# EAGLE design bue_steuerung (EAGLE 7.3.0)
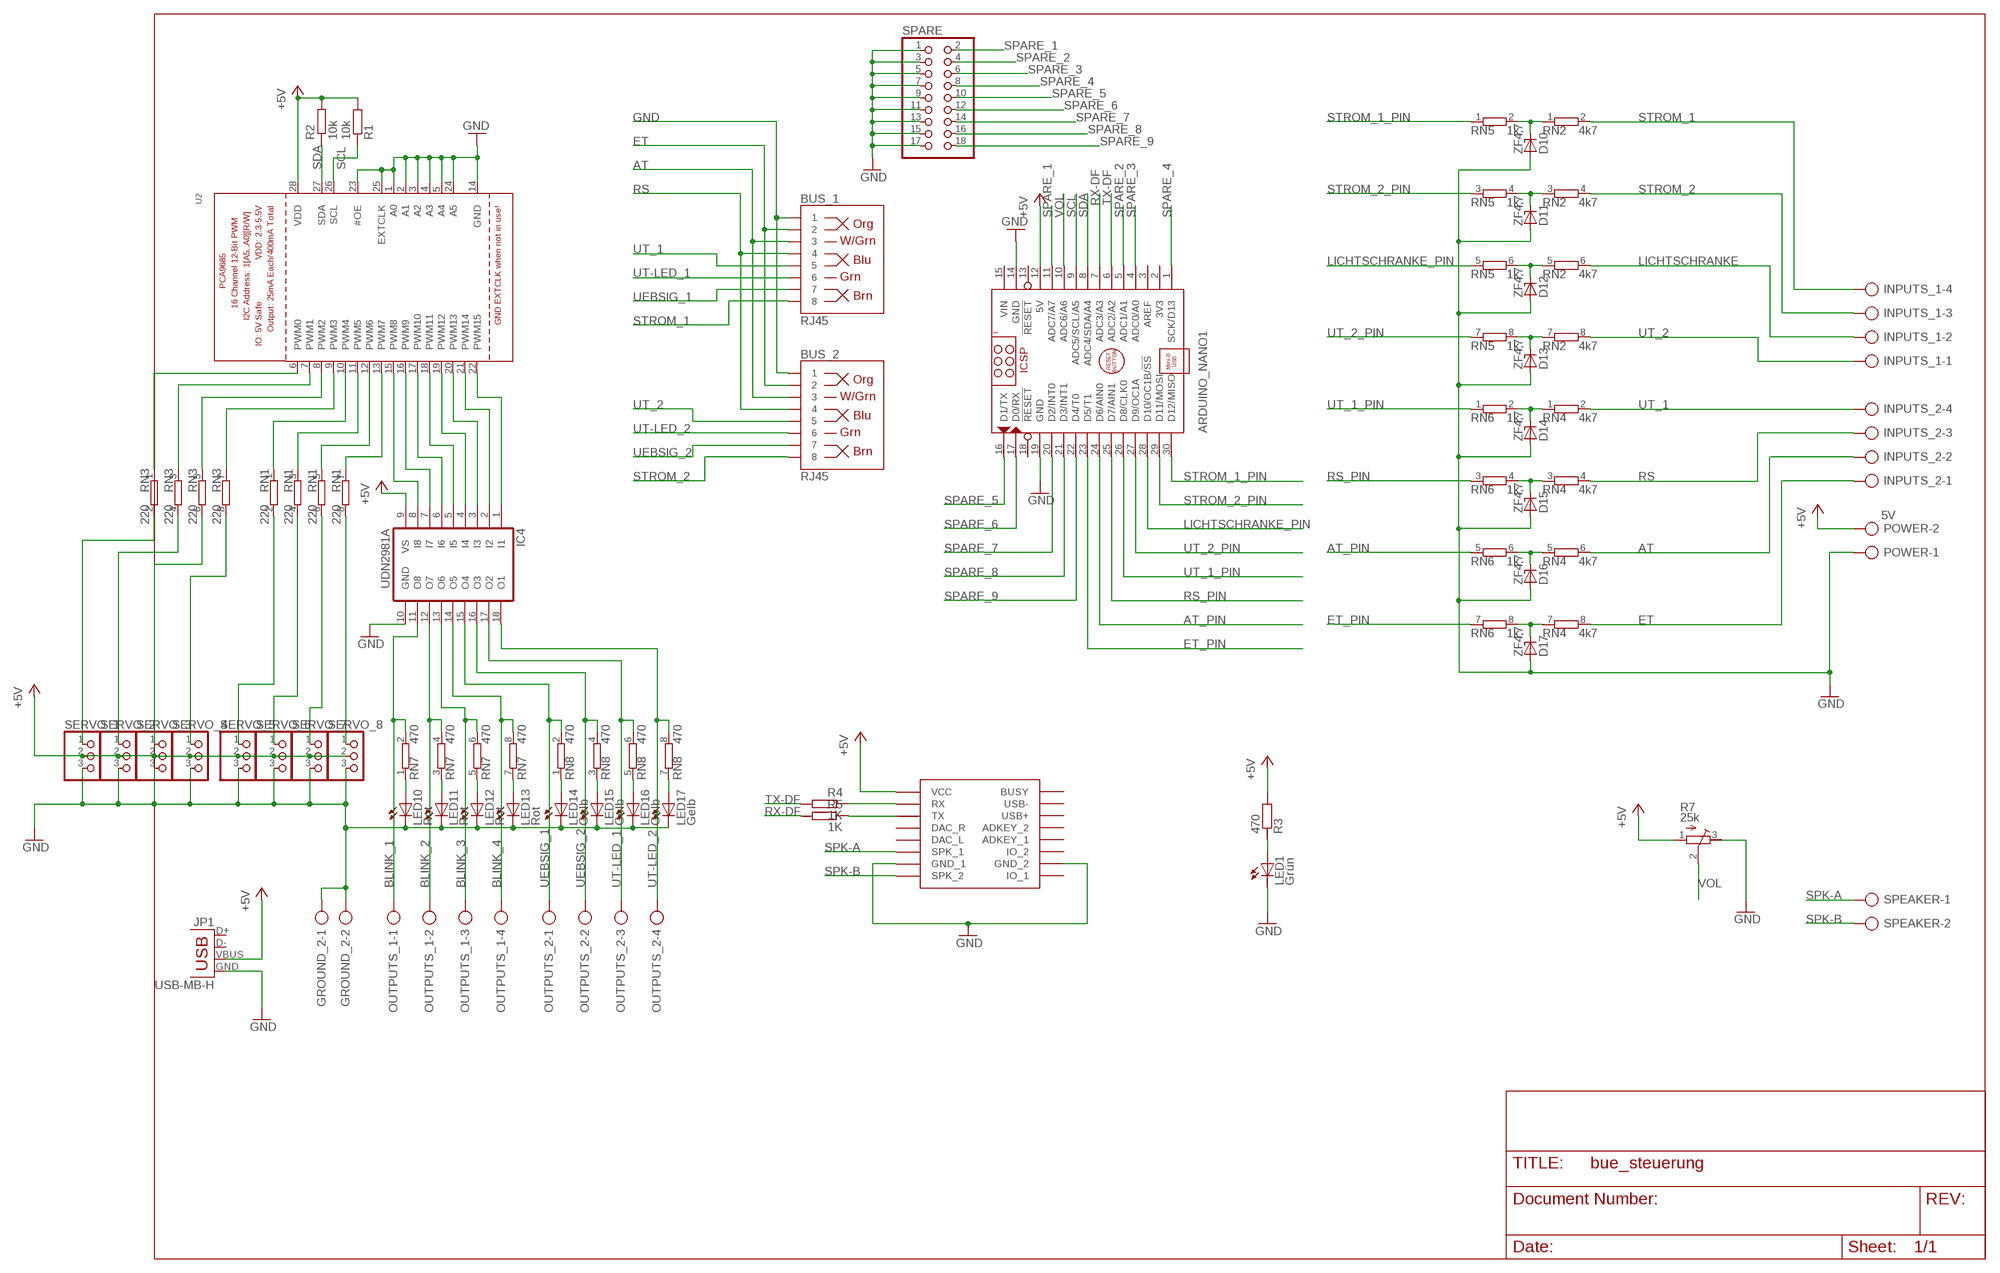
[diagram p0: schematic, sheet 1]

## Parts
ARDUINO_NANO1  ARDUINO_NANO  [ARDUINO_NANO]
BUS_1  RJ45  RJ45-8PTH  [RJ45-8]
BUS_2  RJ45  RJ45-8PTH  [RJ45-8]
D10  ZF4,7  ZENER-DIODEZD-2.5  [ZDIO-2.5]
D11  ZF4,7  ZENER-DIODEZD-5  [ZDIO-5]
D12  ZF4,7  ZENER-DIODEZD-10  [ZDIO-10]
D13  ZF4,7  ZENER-DIODEZD-12.5  [ZDIO12.5]
D14  ZF4,7  ZENER-DIODEZD-12.5  [ZDIO12.5]
D15  ZF4,7  ZENER-DIODEZD-10  [ZDIO-10]
D16  ZF4,7  ZENER-DIODEZD-5  [ZDIO-5]
D17  ZF4,7  ZENER-DIODEZD-2.5  [ZDIO-2.5]
GROUND_2  AK500/2  [AK500/2]
IC4  UDN2981A  [DIL18]
INPUTS_1  AK500/4  [AK500/4]
INPUTS_2  AK500/4  [AK500/4]
JP1  USB-MB-H  [USB-MB-H]
LED1  Grün  LED3MM  [LED3MM]
LED10  Rot  LED3MM  [LED3MM]
LED11  Rot  LED3MM  [LED3MM]
LED12  Rot  LED3MM  [LED3MM]
LED13  Rot  LED3MM  [LED3MM]
LED14  Gelb  LED3MM  [LED3MM]
LED15  Gelb  LED3MM  [LED3MM]
LED16  Gelb  LED3MM  [LED3MM]
LED17  Gelb  LED3MM  [LED3MM]
OUTPUTS_1  AK500/4  [AK500/4]
OUTPUTS_2  AK500/4  [AK500/4]
POWER  5V  AK500/2  [AK500/2]
R1  10k  R-EU_0207/10  [0207/10]
R2  10k  R-EU_0207/10  [0207/10]
R3  470  R-EU_0207/10  [0207/10]
R4  1K  R-EU_0207/10  [0207/10]
R5  1K  R-EU_0207/10  [0207/10]
R7  25k  R-TRIMM64Z  [RTRIM64Z]
RN1  220  E4RP  [SIL8]
RN2  4k7  E4RP  [SIL8]
RN3  220  E4RP  [SIL8]
RN4  4k7  E4RP  [SIL8]
RN5  1k  E4RP  [SIL8]
RN6  1k  E4RP  [SIL8]
RN7  470  E4RP  [SIL8]
RN8  470  E4RP  [SIL8]
SERVO_1  PINHD-1X3  [1X03]
SERVO_2  PINHD-1X3  [1X03]
SERVO_3  PINHD-1X3  [1X03]
SERVO_4  PINHD-1X3  [1X03]
SERVO_5  PINHD-1X3  [1X03]
SERVO_6  PINHD-1X3  [1X03]
SERVO_7  PINHD-1X3  [1X03]
SERVO_8  PINHD-1X3  [1X03]
SPARE  PINHD-2X9  [2X09]
SPEAKER  AK500/2  [AK500/2]
U2  PCA9685  [TSSOP28]
U$1  DFPLAYER  [DFPLAYER]

## Nets
+5V: ARDUINO_NANO1.12(5V) IC4.9(VS) JP1.VBUS POWER.2 R1.2 R2.2 R3.2 R7.1(E) SERVO_1.2 SERVO_2.2 SERVO_3.2 SERVO_4.2 SERVO_5.2 SERVO_6.2 SERVO_7.2 SERVO_8.2 U2.28(VDD) U$1.VCC
AT: BUS_1.3 BUS_2.3 INPUTS_2.2 RN4.6
AT_PIN: ARDUINO_NANO1.24(D6/AIN0) RN6.5
BLINK_1: IC4.11(O8) OUTPUTS_1.1 RN7.2
BLINK_2: IC4.12(O7) OUTPUTS_1.2 RN7.4
BLINK_3: IC4.13(O6) OUTPUTS_1.3 RN7.6
BLINK_4: IC4.14(O5) OUTPUTS_1.4 RN7.8
ET: BUS_1.2 BUS_2.2 INPUTS_2.1 RN4.8
ET_PIN: ARDUINO_NANO1.23(D5/T1) RN6.7
GND: ARDUINO_NANO1.14(GND) ARDUINO_NANO1.19(GND) BUS_1.1 BUS_2.1 D10.A D11.A D12.A D13.A D14.A D15.A D16.A D17.A GROUND_2.1 GROUND_2.2 IC4.10(GND) JP1.GND LED1.K(C) LED10.K(C) LED11.K(C) LED12.K(C) LED13.K(C) LED14.K(C) LED15.K(C) LED16.K(C) LED17.K(C) POWER.1 R7.3(A) SERVO_1.3 SERVO_2.3 SERVO_3.3 SERVO_4.3 SERVO_5.3 SERVO_6.3 SERVO_7.3 SERVO_8.3 SPARE.1 SPARE.3 SPARE.5 SPARE.7 SPARE.9 SPARE.11 SPARE.13 SPARE.15 SPARE.17 U2.1(A0) U2.2(A1) U2.3(A2) U2.4(A3) U2.5(A4) U2.14(GND) U2.23(#OE) U2.24(A5) U2.25(EXTCLK) U$1.GND_1 U$1.GND_2
LICHTSCHRANKE: INPUTS_1.2 RN2.6
LICHTSCHRANKE_PIN: ARDUINO_NANO1.28(D10/OC1B/!SS) RN5.5
N$1: RN1.4 SERVO_6.1
N$2: RN1.6 SERVO_7.1
N$3: RN1.8 SERVO_8.1
N$4: IC4.8(I8) U2.15(PWM8)
N$6: LED14.A RN8.1
N$7: LED1.A R3.1
N$8: R4.1 U$1.RX
N$9: IC4.7(I7) U2.16(PWM9)
N$10: R5.1 U$1.TX
N$13: D17.C RN4.7 RN6.8
N$19: D14.C RN4.1 RN6.2
N$20: D16.C RN4.5 RN6.6
N$21: D15.C RN4.3 RN6.4
N$22: D12.C RN2.5 RN5.6
N$23: D11.C RN2.3 RN5.4
N$24: D10.C RN2.1 RN5.2
N$28: D13.C RN2.7 RN5.8
N$33: IC4.6(I6) U2.17(PWM10)
N$35: IC4.5(I5) U2.18(PWM11)
N$37: IC4.4(I4) U2.19(PWM12)
N$38: IC4.3(I3) U2.20(PWM13)
N$39: RN3.2 SERVO_1.1
N$40: RN3.4 SERVO_2.1
N$41: RN3.6 SERVO_3.1
N$42: RN3.8 SERVO_4.1
N$43: RN1.2 SERVO_5.1
N$45: IC4.2(I2) U2.21(PWM14)
N$46: IC4.1(I1) U2.22(PWM15)
N$47: LED10.A RN7.1
N$48: LED11.A RN7.3
N$49: LED12.A RN7.5
N$50: RN3.1 U2.6(PWM0)
N$51: RN3.3 U2.7(PWM1)
N$52: RN3.5 U2.8(PWM2)
N$53: RN3.7 U2.9(PWM3)
N$54: RN1.1 U2.10(PWM4)
N$55: RN1.3 U2.11(PWM5)
N$56: RN1.5 U2.12(PWM6)
N$57: RN1.7 U2.13(PWM7)
N$58: LED13.A RN7.7
N$59: LED15.A RN8.3
N$60: LED16.A RN8.5
N$62: LED17.A RN8.7
RS: BUS_1.4 BUS_2.4 INPUTS_2.3 RN4.4
RS_PIN: ARDUINO_NANO1.25(D7/AIN1) RN6.3
RX-DF: ARDUINO_NANO1.7(ADC3/A3) R5.2
SCL: ARDUINO_NANO1.9(ADC5/SCL/A5) R1.1 U2.26(SCL)
SDA: ARDUINO_NANO1.8(ADC4/SDA/A4) R2.1 U2.27(SDA)
SPARE_1: ARDUINO_NANO1.11(ADC7/A7) SPARE.2
SPARE_2: ARDUINO_NANO1.5(ADC1/A1) SPARE.4
SPARE_3: ARDUINO_NANO1.4(ADC0/A0) SPARE.6
SPARE_4: ARDUINO_NANO1.1(SCK/D13) SPARE.8
SPARE_5: ARDUINO_NANO1.16(D1/TX) SPARE.10
SPARE_6: ARDUINO_NANO1.17(D0/RX) SPARE.12
SPARE_7: ARDUINO_NANO1.20(D2/INT0) SPARE.14
SPARE_8: ARDUINO_NANO1.21(D3/INT1) SPARE.16
SPARE_9: ARDUINO_NANO1.22(D4/T0) SPARE.18
SPK-A: SPEAKER.1 U$1.SPK1(SPK_1)
SPK-B: SPEAKER.2 U$1.SPK2(SPK_2)
STROM_1: BUS_1.8 INPUTS_1.4 RN2.2
STROM_1_PIN: ARDUINO_NANO1.30(D12/MISO) RN5.1
STROM_2: BUS_2.8 INPUTS_1.3 RN2.4
STROM_2_PIN: ARDUINO_NANO1.29(D11/MOSI) RN5.3
TX-DF: ARDUINO_NANO1.6(ADC2/A2) R4.2
UEBSIG_1: BUS_1.7 IC4.15(O4) OUTPUTS_2.1 RN8.2
UEBSIG_2: BUS_2.7 IC4.16(O3) OUTPUTS_2.2 RN8.4
UT-LED_1: BUS_1.6 IC4.17(O2) OUTPUTS_2.3 RN8.6
UT-LED_2: BUS_2.6 IC4.18(O1) OUTPUTS_2.4 RN8.8
UT_1: BUS_1.5 INPUTS_2.4 RN4.2
UT_1_PIN: ARDUINO_NANO1.26(D8/CLK0) RN6.1
UT_2: BUS_2.5 INPUTS_1.1 RN2.8
UT_2_PIN: ARDUINO_NANO1.27(D9/OC1A) RN5.7
VOL: ARDUINO_NANO1.10(ADC6/A6) R7.2(S)
Unconnected: ARDUINO_NANO1.2(3V3) ARDUINO_NANO1.3(AREF) ARDUINO_NANO1.13(!RESET) ARDUINO_NANO1.18(!RESET) JP1.D+ JP1.D- U$1.ADKEY1(ADKEY_1) U$1.ADKEY2(ADKEY_2) U$1.BUSY U$1.DAC_L U$1.DAC_R U$1.IO1(IO_1) U$1.IO2(IO_2) U$1.USB+ U$1.USB-

## Power pins joined to a net without a drawn wire
VIN: ARDUINO_NANO1.15(VIN)

## Library data of the parts
ARDUINO_NANO1 = ArduinoNanoV30:ARDUINO_NANO: Arduino Nano V3.0 Module Overview: The Arduino Nano is a small, complete, and breadboard-friendly board based on the ATmega328 (Arduino Nano 3.x) or ATmega168 (Arduino Nano 2.x). It has more or less the same functionality of the Arduino Duemilanove, but in a different package. It lacks only a DC power jack, and works with a Mini-B USB cable instead of a standard one. The Nano was designed and is being produced by Gravitech <http://www.gravitech.us/arna30wiatp.html>. General specifications: Item Value Microcontroller Atmel ATmega168 or ATmega328 Operating Voltage (logic level) 5 V Input Voltage (recommended) 7-12 V Input Voltage (limits) 6-20 V Digital I/O Pins 14 (of which 6 provide PWM output) Analog Input Pins 8 DC Current per I/O Pin 40 mA Flash Memory 16 KB (ATmega168) or 32 KB (ATmega328) of which 2 KB used by bootloader SRAM 1 KB (ATmega168) or 2 KB (ATmega328) EEPROM 512 bytes (ATmega168) or 1 KB (ATmega328) Clock Speed 16 MHz Dimensions (Inches) 0.73" x 1.70" Dimensions (mm) 18mm x 45mm Overall height About 9 mm (not including pins) Weigth 5 g Power: The Arduino Nano can be powered via the Mini-B USB connection, 6-20V unregulated external power supply (pin 30), or 5V regulated external power supply (pin 27). The power source is automatically selected to the highest voltage source. Memory: The ATmega168 has 16 KB of flash memory for storing code (of which 2 KB is used for the bootloader); the ATmega328 has 32 KB, (also with 2 KB used for the bootloader). The ATmega168 has 1 KB of SRAM and 512 bytes of EEPROM (which can be read and written with the EEPROM library); the ATmega328 has 2 KB of SRAM and 1 KB of EEPROM. Input and Output: Each of the 14 digital pins on the Nano can be used as an input or output, using pinMode(), digitalWrite(), and digitalRead() functions. They operate at 5 volts. Each pin can provide or receive a maximum of 40 mA and has an internal pull-up resistor (disconnected by default) of 20-50 kOhms. In addition, some pins have specialized functions. Visit Arduino - ArduinoBoardNano <https://www.arduino.cc/en/Main/ArduinoBoardNano>
BUS_1 BUS_2 = SparkFun-Connectors:RJ45-8: RJ45 Jack Simple RJ45, 8-pin connection - connector for common Cat5, Cat5e, and Cat6 Ethernet cables. Footprint not yet proven in production. Connector sku is PRT-00643; Breakout PCB sku is BOB-00716.; PROD_ID: CONN-08506
D10-D17 = diode:ZENER-DIODE: Z-Diode
GROUND_2 POWER SPEAKER = con-ptr500:AK500/2: CONNECTOR; OC_FARNELL: unknown; OC_NEWARK: unknown
IC4 = uln-udn:UDN298*: DRIVER ARRAY Source: Allegro Microsystems Inc. / UDN2981-UDN2984.pdf
INPUTS_1 INPUTS_2 OUTPUTS_1 OUTPUTS_2 = con-ptr500:AK500/4: CONNECTOR; OC_FARNELL: unknown; OC_NEWARK: unknown
JP1 = SparkFun-Connectors:USB: USB Connectors USB-B-PTH is fully proven SKU : PRT-00139/CONN-08278 USB-miniB is fully proven SKU : PRT-00587 USB-A-PCB is untested. USB-A-H is throughly reviewed, but untested. Spark Fun Electronics SKU : PRT-00437 USB-B-SMT is throughly reviewed, but untested. Needs silkscreen touching up. USB-A-S has not been used/tested USB-MB-H has not been used/tested USB-MICROB has been used. CONN-09505
LED1 LED10-LED17 = adafruit:LED: LED OSRAM: - CHIPLED LG R971, LG N971, LY N971, LG Q971, LY Q971, LO R971, LY R971 LH N974, LH R974 LS Q976, LO Q976, LY Q976 LO Q996 - Hyper CHIPLED LW Q18S LB Q993, LB Q99A, LB R99A - SideLED LS A670, LO A670, LY A670, LG A670, LP A670 LB A673, LV A673, LT A673, LW A673 LH A674 LY A675 LS A676, LA A676, LO A676, LY A676, LW A676 LS A679, LY A679, LG A679 - Hyper Micro SIDELED® LS Y876, LA Y876, LO Y876, LY Y876 LT Y87S - SmartLED LW L88C, LW L88S LB L89C, LB L89S, LG L890 LS L89K, LO L89K, LY L89K LS L896, LA L896, LO L896, LY L896 - TOPLED LS T670, LO T670, LY T670, LG T670, LP T670 LSG T670, LSP T670, LSY T670, LOP T670, LYG T670 LG T671, LOG T671, LSG T671 LB T673, LV T673, LT T673, LW T673 LH T674 LS T676, LA T676, LO T676, LY T676, LB T676, LH T676, LSB T676, LW T676 LB T67C, LV T67C, LT T67C, LS T67K, LO T67K, LY T67K, LW E67C LS E67B, LA E67B, LO E67B, LY E67B, LB E67C, LV E67C, LT E67C LW T67C LS T679, LY T679, LG T679 LS T770, LO T770, LY T770, LG T770, LP T770 LB T773, LV T773, LT T773, LW T773 LH T774 LS E675, LA E675, LY E675, LS T675 LS T776, LA T776, LO T776, LY T776, LB T776 LHGB T686 LT T68C, LB T68C - Hyper Mini TOPLED® LB M676 - Mini TOPLED Santana® LG M470 LS M47K, LO M47K, LY M47K Source: http://www.osram.convergy.de/
R1-R5 = resistor:R-EU_: RESISTOR, European symbol
R7 = resistor:R-TRIMM: Trimm resistor
RN1-RN8 = resistor-sil:E4RP: SIL RESISTOR; OC_FARNELL: unknown; OC_NEWARK: unknown
SERVO_1-SERVO_8 = pinhead:PINHD-1X3: PIN HEADER
SPARE = pinhead:PINHD-2X9: PIN HEADER
U2 = adafruit:PCA9685: PCA9685 - 16 Channel 12-Bit I2C PWM Controller 5.0V tolerant 16 channel, 12-bit I2C PWM controller with 25mA per output (max. 400mA total) Digikey: 568-5931-1-ND
U$1 = DFPlayer_v1:DFPLAYER

## Board
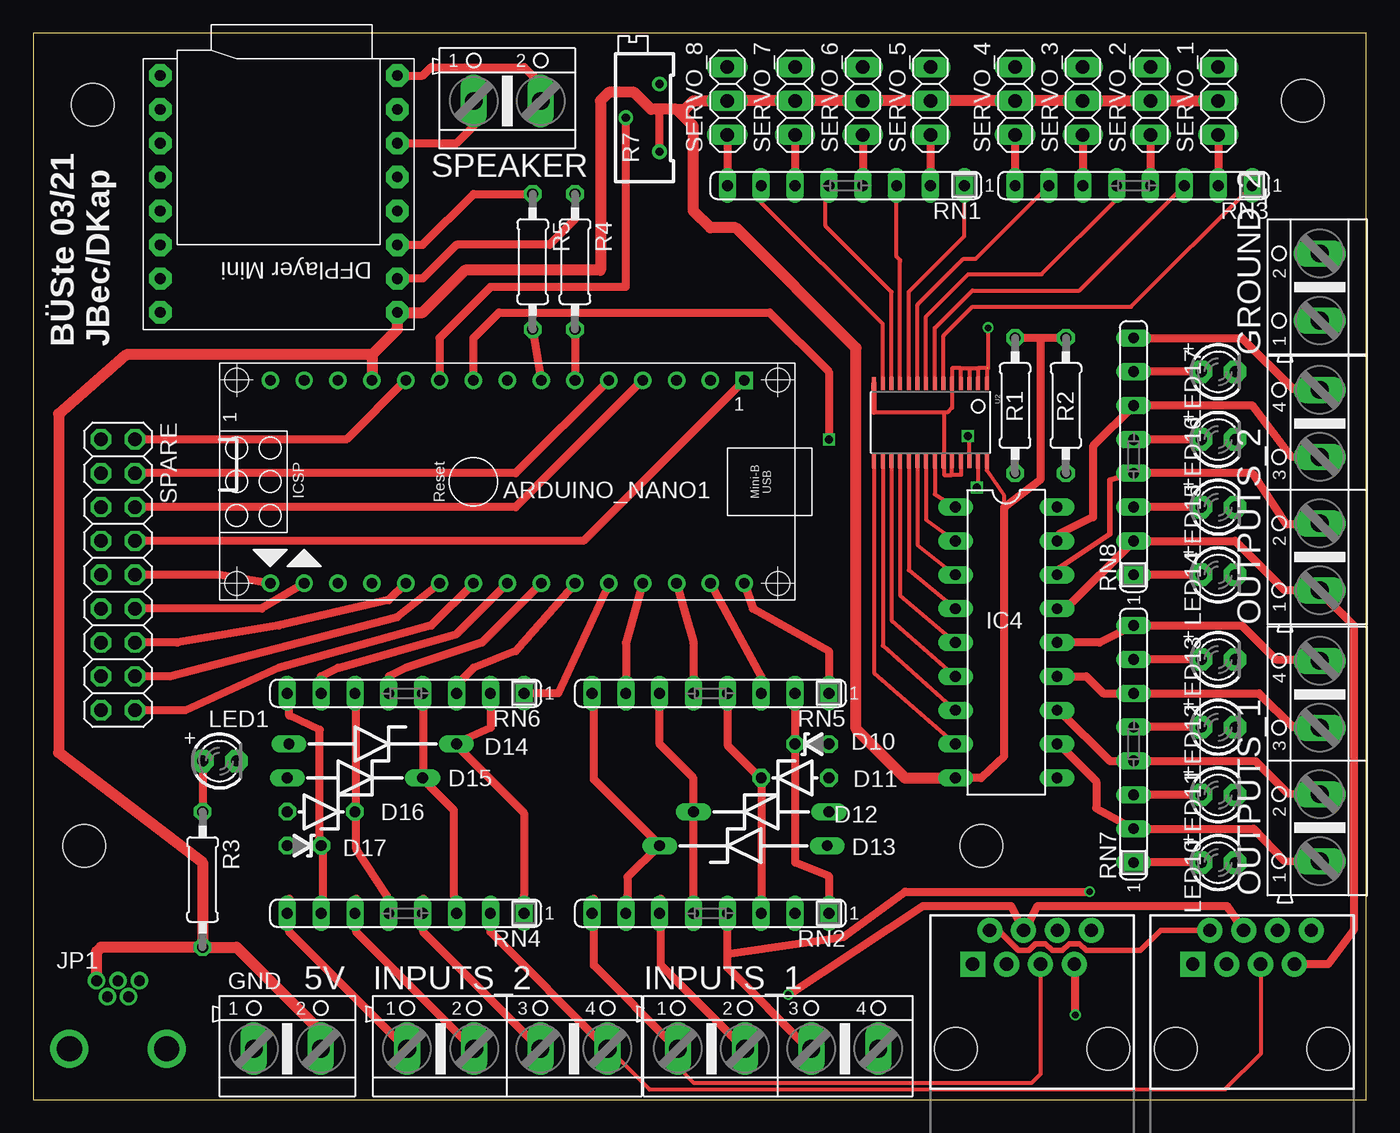
[diagram p1: board, top side]
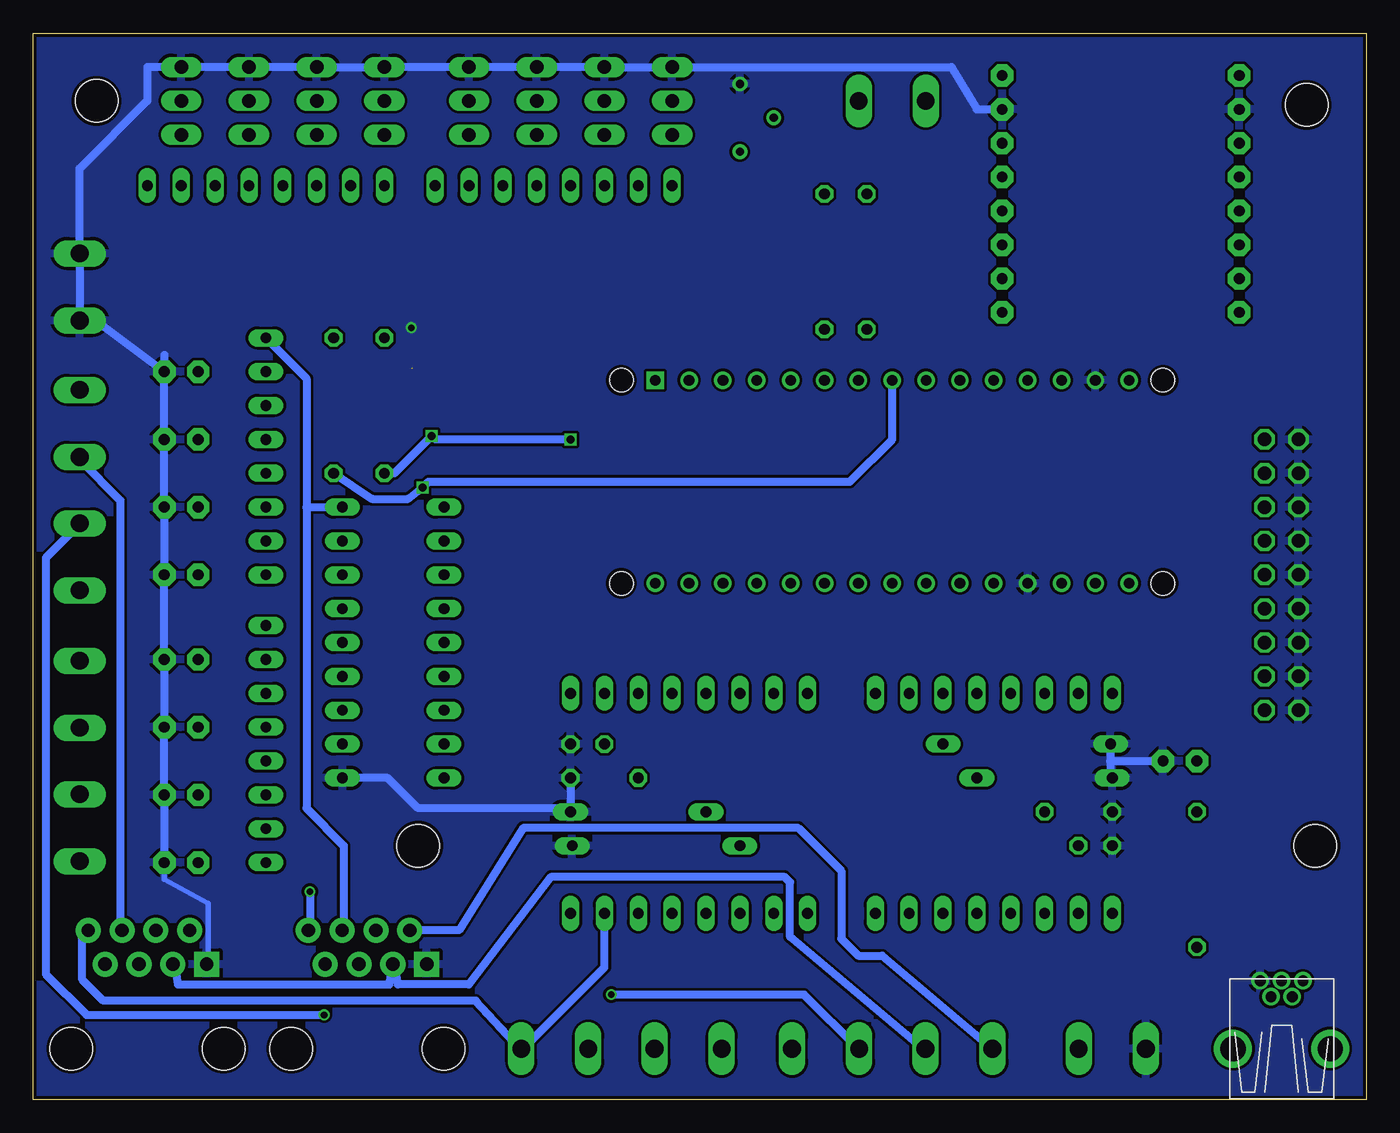
[diagram p2: board, bottom side, seen from below]

Size 100 x 80 mm. Coordinates in mm from the lower left corner, seen from the top.
Outline: 0,0 100,0 100,80 0,80 0,0
Copper layers (1*16): Top 0.035mm / dielectric 1.5mm / Bottom 0.035mm
Design rules "ITEADstudio_DRC_smaller_pad_restrings *": minimum track width 12mil, minimum drill 12mil, track to track 8mil, track to pad 8mil, pad to pad 8mil, via to via 8mil, smd to smd 0mil, copper to edge 10mil, drill to drill 10mil, minimum pad ring 10mil, minimum via ring 6mil, stop-mask expansion 2mil, vias tented up to drill 100mil, thermal gap 10mil
Holes 3.2 mm at 95.25,74.93 3.81,19.05 4.47,74.63 71.12,19.05

### Footprints (pad centres in the part's own frame; a part is rotated, then mirrored left to right if it is on the bottom)
ARDUINO_NANO = drill 0.8 square: 1 -20.32,-7.62 | drill 0.8: 2 -17.78,-7.62; 3 -15.24,-7.62; 4 -12.7,-7.62; 5 -10.16,-7.62; 6 -7.62,-7.62; 7 -5.08,-7.62; 8 -2.54,-7.62; 9 0,-7.62; 10 2.54,-7.62; 11 5.08,-7.62; 12 7.62,-7.62; 13 10.16,-7.62; 14 12.7,-7.62; 15 15.24,-7.62; 16 15.24,7.62; 17 12.7,7.62; 18 10.16,7.62; 19 7.62,7.62; 20 5.08,7.62; 21 2.54,7.62; 22 0,7.62; 23 -2.54,7.62; 24 -5.08,7.62; 25 -7.62,7.62; 26 -10.16,7.62; 27 -12.7,7.62; 28 -15.24,7.62; 29 -17.78,7.62; 30 -20.32,7.62 | hole 1.778: -22.86,-7.62; -22.86,7.62; 17.78,7.62; 17.78,-7.62
RJ45-8 = drill 1 pad 1.88 square: 1 -4.445,6.35 | drill 1 pad 1.88: 2 -3.175,8.89; 3 -1.905,6.35; 4 -0.635,8.89; 5 0.635,6.35; 6 1.905,8.89; 7 3.175,6.35; 8 4.445,8.89 | hole 3.2: -5.715,0; 5.715,0
ZDIO-2.5 = drill 0.813 octagon: A 1.27,0; C -1.27,0
ZDIO-5 = drill 0.813 octagon: A 2.54,0; C -2.54,0
ZDIO-10 = drill 0.813 long: A 5.08,0; C -5.08,0
ZDIO12.5 = drill 0.813 long: A 6.223,0; C -6.35,0
AK500/2 = drill 1.321 long: 1 -2.515,0; 2 2.515,0
DIL18 = drill 0.813 long: 1 -10.16,-3.81; 2 -7.62,-3.81; 3 -5.08,-3.81; 4 -2.54,-3.81; 5 0,-3.81; 6 2.54,-3.81; 7 5.08,-3.81; 8 7.62,-3.81; 9 10.16,-3.81; 10 10.16,3.81; 11 7.62,3.81; 12 5.08,3.81; 13 2.54,3.81; 14 0,3.81; 15 -2.54,3.81; 16 -5.08,3.81; 17 -7.62,3.81; 18 -10.16,3.81
AK500/4 = drill 1.321 long: 1 -7.518,0; 2 -2.489,0; 3 2.489,0; 4 7.518,0
USB-MB-H = drill 0.8: D+ 5.1,0; D- 3.9,0.8; GND 5.1,-1.6; ID 3.9,-0.8; VBUS 5.1,1.6 | drill 1.9: P$6 0,-3.65; P$7 0,3.65
LED3MM = drill 0.813 pad 1.676 octagon: A -1.27,0; K 1.27,0
0207/10 = drill 0.813 octagon: 1 -5.08,0; 2 5.08,0
RTRIM64Z = drill 0.61: 1 0,-2.54; 2 -2.54,0; 3 0,2.54
SIL8 = drill 0.813 long: 1 -8.89,0; 2 -6.35,0; 3 -3.81,0; 4 -1.27,0; 5 1.27,0; 6 3.81,0; 7 6.35,0; 8 8.89,0
1X03 = drill 1.016 long: 1 -2.54,0; 2 0,0; 3 2.54,0
2X09 = drill 1.016 octagon: 1 -10.16,-1.27; 2 -10.16,1.27; 3 -7.62,-1.27; 4 -7.62,1.27; 5 -5.08,-1.27; 6 -5.08,1.27; 7 -2.54,-1.27; 8 -2.54,1.27; 9 0,-1.27; 10 0,1.27; 11 2.54,-1.27; 12 2.54,1.27; 13 5.08,-1.27; 14 5.08,1.27; 15 7.62,-1.27; 16 7.62,1.27; 17 10.16,-1.27; 18 10.16,1.27
TSSOP28 = smd 0.305 x 0.991: 1 -4.225,-2.918; 2 -3.575,-2.918; 3 -2.925,-2.918; 4 -2.275,-2.918; 5 -1.625,-2.918; 6 -0.975,-2.918; 7 -0.325,-2.918; 8 0.325,-2.918; 9 0.975,-2.918; 10 1.625,-2.918; 11 2.275,-2.918; 12 2.925,-2.918; 13 3.575,-2.918; 14 4.225,-2.918; 15 4.225,2.918; 16 3.575,2.918; 17 2.925,2.918; 18 2.275,2.918; 19 1.625,2.918; 20 0.975,2.918; 21 0.325,2.918; 22 -0.325,2.918; 23 -0.975,2.918; 24 -1.625,2.918; 25 -2.275,2.918; 26 -2.925,2.918; 27 -3.575,2.918; 28 -4.225,2.918
DFPLAYER = drill 0.8 pad 1.676 octagon: ADKEY1 8.89,-1.27; ADKEY2 8.89,1.27; BUSY 8.89,8.89; DAC_L -8.89,-1.27; DAC_R -8.89,1.27; GND_1 -8.89,-6.35; GND_2 8.89,-6.35; IO1 8.89,-8.89; IO2 8.89,-3.81; RX -8.89,6.35; SPK1 -8.89,-3.81; SPK2 -8.89,-8.89; TX -8.89,3.81; USB+ 8.89,3.81; USB- 8.89,6.35; VCC -8.89,8.89

### Placement (x,y rotation side)
ARDUINO_NANO1  33.02,46.35 180 top
BUS_1  91.44,3.81 0 top
BUS_2  74.93,3.81 0 top
D10  58.42,26.67 0 top
D11  57.15,24.13 0 top
D12  54.61,21.59 0 top
D13  53.34,19.05 0 top
D14  25.4,26.67 180 top
D15  24.13,24.13 180 top
D16  21.59,21.59 180 top
D17  20.32,19.05 180 top
GROUND_2  96.52,60.96 90 top
IC4  73,34.29 270 top
INPUTS_1  55.88,3.81 0 top
INPUTS_2  35.56,3.81 0 top
JP1  6.35,3.81 90 top
LED1  13.97,25.4 0 top
LED10  88.9,17.78 0 top
LED11  88.9,22.86 0 top
LED12  88.9,27.94 0 top
LED13  88.9,33.02 0 top
LED14  88.9,39.37 0 top
LED15  88.9,44.45 0 top
LED16  88.9,49.53 0 top
LED17  88.9,54.61 0 top
OUTPUTS_1  96.52,25.4 90 top
OUTPUTS_2  96.52,45.72 90 top
POWER  19.05,3.81 0 top
R1  73.66,52.07 90 top
R2  77.47,52.07 90 top
R3  12.7,16.51 270 top
R4  40.64,62.87 270 top
R5  37.47,62.87 270 top
R7  46.99,73.66 0 top
RN1  60.96,68.58 180 top
RN2  50.8,13.97 180 top
RN3  82.55,68.58 180 top
RN4  27.94,13.97 180 top
RN5  50.8,30.48 180 top
RN6  27.94,30.48 180 top
RN7  82.55,26.67 90 top
RN8  82.55,48.26 90 top
SERVO_1  88.9,74.93 90 top
SERVO_2  83.82,74.93 90 top
SERVO_3  78.74,74.93 90 top
SERVO_4  73.66,74.93 90 top
SERVO_5  67.31,74.93 90 top
SERVO_6  62.23,74.93 90 top
SERVO_7  57.15,74.93 90 top
SERVO_8  52.07,74.93 90 top
SPARE  6.35,39.37 270 top
SPEAKER  35.56,74.93 0 top
U2  67.31,50.8 180 top
U$1  18.41,67.94 180 top

### Tracks (layer width: path | path; a pad name or v marks a point on that pad's centre or on a via)
+5V
  Top 0.305: 72.85,44.45 72.85,45.26 71.53,47.21 U2.28
  Top 0.61: SERVO_8.2 SERVO_7.2 SERVO_6.2 SERVO_5.2 SERVO_4.2 | R2.2 75.56,57.15 | 75.56,57.15 R1.2 | IC4.9 71.12,24.13 72.85,25.76 72.85,44.45 75.56,46.53 75.56,57.15 | R7.1 46.99,74.3
  Top 0.813: SERVO_1.2 SERVO_2.2 SERVO_3.2 SERVO_4.2 SERVO_8.2 49.53,74.93 48.9,74.3 48.26,74.3 | 25.4,55.88 6.99,55.88 1.91,51.44 1.91,26.04 12.7,17.78 R3.2 | R3.2 5.08,11.43 4.75,11.1 JP1.VBUS | R3.2 15.24,11.43 21.59,5.08 21.59,3.83 POWER.2 | 25.4,55.88 27.3,57.78 U$1.VCC 29.21,59.05 32.38,62.23 42.55,62.23 42.55,74.93 43.18,75.56 45.09,75.56 46.35,74.3 46.99,74.3 48.26,74.3 | 48.26,74.3 49.53,73.03 49.53,66.67 50.8,65.41 52.7,65.41 61.72,56.39 61.72,27.81 65.41,24.13 IC4.9 | 25.4,55.88 ARDUINO_NANO1.12
AT
  Top 0.406: 32.92,3.89 INPUTS_2.2
  Top 0.61: 32.92,3.89 24.23,12.57 24.23,15.09 RN4.6
  Bottom 0.305: 72.9,10.16 BUS_2.3 | 33.27,3.81 INPUTS_2.2
  Bottom 0.61: BUS_1.3 89.41,10.16 89.15,8.64 73.28,8.64 BUS_2.3 | 72.9,10.16 72.64,8.64 67.31,8.64 61.16,16.69 43.64,16.69 43.23,16.31 43.23,12.19 33.27,3.81
AT_PIN
  Top 0.61: ARDUINO_NANO1.24 33.66,34.29 27.94,32.38 26.67,31.75 RN6.5
BLINK_1
  Top 0.406: 76.96,26.67 IC4.11
  Top 0.61: OUTPUTS_1.1 93.85,17.91 91.57,20.32 RN7.2 79.76,21.84 79.76,23.88 76.96,26.67
BLINK_2
  Top 0.305: 76.96,29.21 IC4.12
  Top 0.61: OUTPUTS_1.2 94.11,22.99 91.69,25.4 RN7.4 80.77,25.4 76.96,29.21
BLINK_3
  Top 0.305: 96.52,27.94 OUTPUTS_1.3
  Top 0.61: IC4.13 78.99,31.75 80.26,30.48 RN7.6 91.95,30.48 94.49,27.94 96.52,27.94
BLINK_4
  Top 0.305: 96.52,33.02 OUTPUTS_1.4
  Top 0.61: IC4.14 80.01,34.29 RN7.8 90.68,35.56 93.22,33.02 96.52,33.02
ET
  Top 0.406: 27.89,3.89 INPUTS_2.1 | BUS_2.2 72.39,12.7 73.91,11.18 74.68,11.18 75.18,11.68 75.95,11.68 76.45,11.18 77.22,11.18 77.72,11.68 78.49,11.68 78.99,11.18 83.06,11.18 84.58,12.7 BUS_1.2
  Top 0.61: 27.89,3.89 19.2,12.57 19.2,15.09 RN4.8
  Bottom 0.305: 28.19,3.81 INPUTS_2.1
  Bottom 0.61: BUS_2.2 68.07,12.7 63.25,20.37 42.6,20.37 39.37,17.14 39.37,12.06 38.1,10.79 36.3,10.79 INPUTS_2.1
ET_PIN
  Top 0.61: ARDUINO_NANO1.23 31.75,34.92 22.86,32.38 21.59,31.75 RN6.7
GND  (via drill 0.5)  (1 unrouted)
  Top 0.305: 69.6,48.01 U2.25 69.6,46.86 68.94,46.86 | 68.33,51.56 68.58,51.56 68.94,51.92 U2.5 68.94,54.86 69.6,54.86 | 68.33,51.56 63.12,51.56 63.09,51.6 | 68.33,51.56 68.33,48.01 | 68.33,48.01 U2.23 | v71.63,57.91 71.63,54.86 | U2.4 69.6,54.86 | 68.94,46.86 U2.24 | 68.33,48.01 68.33,46.86 68.94,46.86 | 69.6,54.86 70.23,54.86 | 70.23,54.86 70.89,54.86 | U2.1 71.53,54.86 70.89,54.86 | 70.23,54.86 U2.3 | 70.89,54.86 U2.2
  Top 0.406: 63.09,51.6 U2.14
  Bottom 0.305: 59.66,21.72 59.66,21.84 | 96.52,63.25 GROUND_2.2 | 96.52,58.42 GROUND_2.1
  Bottom 0.406: LED10.K 90.17,16.51 86.87,14.73 86.87,10.16 BUS_1.1
  Bottom 0.61: 59.66,24 59.66,21.84 71.12,21.84 73.41,24.13 IC4.10 | 19.2,26.52 19.2,25.4 | 19.2,25.4 19.2,24.23 | LED17.K LED16.K LED15.K LED14.K LED13.K LED12.K LED11.K LED10.K | 19.2,25.4 LED1.K | GROUND_2.1 GROUND_2.2 96.52,69.85 91.44,74.93 91.44,77.47 SERVO_1.3 SERVO_2.3 SERVO_3.3 SERVO_4.3 SERVO_5.3 SERVO_6.3 SERVO_7.3 SERVO_8.3 31.11,77.47 29.21,74.3 U$1.GND_1 | 96.52,58.42 95.25,58.42 LED17.K | 90.17,55.88 LED17.K
  pour Bottom: 0,80.01 100.33,80.01 100.33,0 0,0
LICHTSCHRANKE
  Top 0.305: 53.26,3.89 INPUTS_1.2
  Top 0.61: 53.26,3.89 47.09,10.06 47.09,15.09 RN2.6
LICHTSCHRANKE_PIN
  Top 0.61: ARDUINO_NANO1.28 49.53,34.29 RN5.5
N$1
  Top 0.61: SERVO_6.1 RN1.4
N$2
  Top 0.61: SERVO_7.1 RN1.6
N$3
  Top 0.61: SERVO_8.1 RN1.8
N$4
  Top 0.305: U2.15 63.09,32.01 IC4.8
N$6
  Top 0.61: LED14.A RN8.1
N$7
  Top 0.61: LED1.A R3.1
N$8
  Top 0.61: R4.1 40.64,66.04 38.73,64.14 31.75,64.14 29.21,61.59 U$1.RX
N$9
  Top 0.305: U2.16 63.73,34.05 IC4.7
N$10
  Top 0.61: U$1.TX 29.21,64.14 33.02,67.94 R5.1
N$13
  Top 0.305: 21.49,19.2 D17.C
  Top 0.61: RN4.7 21.72,15.32 21.72,18.97 D17.C | 21.49,19.2 21.49,27.74 19.2,28.8 19.2,30.4 RN6.8
N$19
  Top 0.305: 31.77,26.75 D14.C 31.77,26.52 | 34.29,30.4 RN6.2
  Top 0.406: 36.8,15.32 RN4.1
  Top 0.61: 31.77,26.75 34.31,27.89 34.29,30.4 | 36.8,15.32 36.8,21.49 31.77,26.52
N$20
  Top 0.305: 24.23,21.49 D16.C | 26.52,15.32 RN4.5
  Top 0.406: 24.23,21.72 D16.C
  Top 0.61: 24.23,21.49 24.23,18.82 26.52,15.32 | 24.23,21.72 24.23,30.4 RN6.6
N$21
  Top 0.305: 29.26,30.4 RN6.4 | 29.26,24 D15.C
  Top 0.406: 29.26,24.23 D15.C
  Top 0.61: 29.26,30.4 29.26,24.23 | 29.26,24 31.55,21.72 31.55,15.32 RN4.3
N$22
  Top 0.61: RN2.5 D12.C 49.53,24.13 46.99,26.67 RN5.6
N$23
  Top 0.305: 54.63,24 D11.C | 52.12,30.4 RN5.4
  Top 0.61: 54.63,24 54.63,15.32 RN2.3 | 52.12,30.4 52.12,26.52 54.41,24.23 D11.C
N$24
  Top 0.61: RN5.2 D10.C 57.15,17.78 59.69,16.76 RN2.1
N$28
  Top 0.305: 46.86,18.97 D13.C 46.86,19.2
  Top 0.61: 46.86,18.97 44.58,16.69 44.58,15.32 RN2.7 | 46.86,19.2 42.06,24 42.06,30.4 RN5.8
N$33
  Top 0.305: U2.17 64.39,35.95 IC4.6
N$35
  Top 0.305: U2.18 65.03,37.84 IC4.5
N$37
  Top 0.305: U2.19 65.69,39.73 IC4.4
N$38
  Top 0.305: U2.20 66.33,41.62 IC4.3
N$39
  Top 0.61: SERVO_1.1 RN3.2
N$40
  Top 0.61: SERVO_2.1 RN3.4
N$41
  Top 0.61: SERVO_3.1 RN3.6
N$42
  Top 0.61: SERVO_4.1 RN3.8
N$43
  Top 0.61: SERVO_5.1 RN1.2
N$45
  Top 0.305: U2.21 66.98,43.51 IC4.2
N$46
  Top 0.305: U2.22 67.64,45.4 IC4.1
N$47
  Top 0.61: LED10.A RN7.1
N$48
  Top 0.61: LED11.A RN7.3
N$49
  Top 0.61: LED12.A RN7.5
N$50
  Top 0.305: U2.6 68.28,57.31 70.46,59.49 82.35,59.49 RN3.1
N$51
  Top 0.305: U2.7 67.64,57.88 70.46,60.71 78.49,60.71 RN3.3
N$52
  Top 0.305: U2.8 66.98,58.76 70.16,61.92 75.64,61.92 81.28,67.56 RN3.5
N$53
  Top 0.305: U2.9 66.33,59.63 69.8,63.09 70.71,63.09 RN3.7
N$54
  Top 0.305: U2.10 65.69,60.6 69.85,64.77 RN1.1
N$55
  Top 0.305: U2.11 65.03,62.9 65.02,62.99 64.77,63.25 RN1.3
N$56
  Top 0.305: U2.12 64.39,60.58 59.44,65.53 59.44,68.33 RN1.5
N$57
  Top 0.305: U2.13 63.73,58.19 54.61,67.31 RN1.7
N$58
  Top 0.61: LED13.A RN7.7
N$59
  Top 0.61: LED15.A RN8.3
N$60
  Top 0.61: LED16.A RN8.5
N$62
  Top 0.61: LED17.A RN8.7
RS  (via drill 0.5)
  Top 0.305: 29.26,15.09 RN4.4 | 37.95,3.89 INPUTS_2.3 | 74.42,12.7 BUS_2.4
  Top 0.61: 29.26,15.09 29.26,12.57 37.95,3.89 | BUS_2.4 73.36,14.53 66.75,14.53 v56.64,7.87 | BUS_1.4 89.56,14.53 75.34,14.53 74.42,12.7
  Bottom 0.305: 38.1,3.81 INPUTS_2.3
  Bottom 0.61: v56.64,7.87 42.16,7.87 38.1,3.81
RS_PIN
  Top 0.61: ARDUINO_NANO1.25 36.2,33.66 33.02,32.38 31.75,31.11 RN6.3
RX-DF
  Top 0.61: R5.2 ARDUINO_NANO1.7
SCL  (via drill 0.6)
  Top 0.305: U2.26 70.23,49.65 v70.1,49.78
  Top 0.61: ARDUINO_NANO1.9 33.02,57.15 34.92,59.05 55.24,59.05 59.69,54.61 v59.69,49.53
  Bottom 0.406: 69.85,49.53 v70.1,49.78
  Bottom 0.61: R1.1 72.9,46.99 v70.1,49.78 | v59.69,49.53 69.85,49.53
SDA  (via drill 0.6)
  Top 0.305: U2.27 70.89,46.03 v70.78,45.93
  Bottom 0.305: v70.78,45.93 71.01,45.93 71.88,45.06
  Bottom 0.61: R2.1 74.57,45.06 71.88,45.06 v70.78,45.93 70.36,46.35 38.73,46.35 35.56,49.53 ARDUINO_NANO1.8
SPARE_1
  Top 0.61: ARDUINO_NANO1.11 23.5,49.53 SPARE.2
SPARE_2
  Top 0.61: ARDUINO_NANO1.5 36.2,46.99 SPARE.4
SPARE_3
  Top 0.61: ARDUINO_NANO1.4 36.2,44.45 SPARE.6
SPARE_4
  Top 0.61: ARDUINO_NANO1.1 41.27,41.91 SPARE.8
SPARE_5
  Top 0.61: ARDUINO_NANO1.16 13.97,39.37 SPARE.10
SPARE_6
  Top 0.61: ARDUINO_NANO1.17 17.14,36.83 SPARE.12
SPARE_7
  Top 0.61: ARDUINO_NANO1.20 26.67,37.47 18.41,35.56 10.79,34.29 SPARE.14
SPARE_8
  Top 0.61: ARDUINO_NANO1.21 27.3,36.2 10.16,31.75 SPARE.16
SPARE_9
  Top 0.61: ARDUINO_NANO1.22 29.84,35.56 18.41,32.38 11.43,29.21 SPARE.18
SPK-A
  Top 0.61: U$1.SPK1 31.75,71.75 33.02,73.03 33.02,74.91 SPEAKER.1
SPK-B
  Top 0.61: U$1.SPK2 29.21,76.83 29.84,77.47 36.83,77.47 38.1,76.2 38.1,74.95 SPEAKER.2
STROM_1
  Bottom 0.305: 63.25,3.81 INPUTS_1.4 63.5,3.81
  Bottom 0.61: RN2.2 57.15,9.91 63.25,3.81 | 63.5,3.81 66.8,7.42 94.74,7.42 96.32,8.99 96.32,12.27 BUS_1.8
STROM_1_PIN
  Top 0.61: ARDUINO_NANO1.30 53.98,36.83 59.69,33.66 RN5.1
STROM_2  (via drill 0.5)
  Top 0.305: 58.17,3.81 INPUTS_1.3
  Top 0.61: 52.07,10.95 52.07,9.91 58.17,3.81 | 52.07,10.95 RN2.4 | v79.25,15.6 65.43,15.6 60.83,12.22 52.07,10.95
  Bottom 0.61: v79.25,15.6 79.25,12.7 BUS_2.8
STROM_2_PIN
  Top 0.61: ARDUINO_NANO1.29 54.61,31.75 RN5.3
TX-DF
  Top 0.61: R4.2 ARDUINO_NANO1.6
UEBSIG_1
  Top 0.305: 96.52,38.1 OUTPUTS_2.1
  Top 0.61: BUS_1.7 97.16,10.16 99.06,12.7 99.06,35.56 96.52,38.1 | IC4.15 77.47,36.83 RN8.2 90.17,41.91 93.88,38.2 OUTPUTS_2.1
UEBSIG_2  (via drill 0.5)
  Top 0.406: 76.96,39.37 76.96,39.88 80.77,42.42 80.77,46.48 RN8.4
  Top 0.61: 76.96,39.37 IC4.16 | RN8.4 91.44,46.99 93.98,43.18 96.47,43.18 OUTPUTS_2.2 | v78.18,6.35 78.18,10.08 BUS_2.7
  Bottom 0.305: 96.52,43.18 OUTPUTS_2.2
  Bottom 0.61: v78.18,6.35 96.01,6.35 99.06,9.4 99.06,40.64 96.52,43.18
UT-LED_1
  Top 0.61: IC4.17 76.96,41.91 76.96,42.42 79.5,43.69 79.5,49.02 RN8.6 91.44,52.07 94.36,48.26 OUTPUTS_2.3
  Bottom 0.305: 96.52,48.01 OUTPUTS_2.3
  Bottom 0.61: 96.52,48.01 93.47,44.96 93.47,12.7 BUS_1.6
UT-LED_2
  Top 0.305: 96.52,53.34 OUTPUTS_2.4
  Top 0.61: 96.52,53.34 94.49,53.34 90.68,57.15 RN8.8
  Bottom 0.61: 79.5,44.45 79.5,54.1 RN8.8 | 79.5,44.45 79.5,21.84 76.71,19.05 76.71,12.7 BUS_2.6 | 79.5,44.45 IC4.18
UT_1
  Top 0.305: 42.98,3.89 INPUTS_2.4 43.18,3.81 46.23,0.76 89.41,0.76 92.08,3.43 BUS_1.5
  Top 0.61: RN4.2 34.29,12.57 42.98,3.89
UT_1_PIN
  Top 0.61: ARDUINO_NANO1.26 39.37,30.48 RN6.1
UT_2
  Top 0.305: 48.23,3.89 INPUTS_1.1 48.36,2.44 49.53,1.27 74.93,1.27 75.56,1.91 BUS_2.5
  Top 0.61: 48.23,3.89 42.06,10.06 42.06,15.09 RN2.8
UT_2_PIN
  Top 0.61: ARDUINO_NANO1.27 44.45,34.29 RN5.7
VOL
  Top 0.61: R7.2 44.45,60.96 34.29,60.96 30.48,57.15 ARDUINO_NANO1.10

### Text on the board
tNames: BÜSte 03/21 / JBec/DKap | GND | 5V